# Altium schematic sheet Auxiliary.SchDoc: Auxiliary Components
size A4; DocumentNumber: 8; SheetNumber: 8; SheetTotal: 8
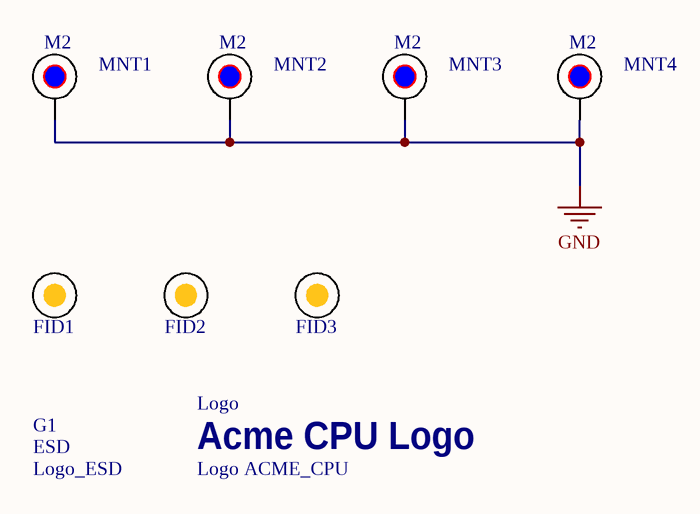
[diagram p0: Auxiliary.SchDoc]

## Parts
FID1  N/A  [Fiducial]  (value not drawn)  (no BOM)
FID2  N/A  [Fiducial]  (value not drawn)  (no BOM)
FID3  N/A  [Fiducial]  (value not drawn)  (no BOM)
G1  Logo_ESD  [Logo_ESD]  (no BOM)
Logo  Logo ACME_CPU  [LOGO_ACME_CPU]  (no BOM)
MNT1  MountHole M2. Nothing to buy or mount  [MountHole_M2]  (value not drawn)  (no BOM)
MNT2  MountHole M2. Nothing to buy or mount  [MountHole_M2]  (value not drawn)  (no BOM)
MNT3  MountHole M2. Nothing to buy or mount  [MountHole_M2]  (value not drawn)  (no BOM)
MNT4  MountHole M2. Nothing to buy or mount  [MountHole_M2]  (value not drawn)  (no BOM)

## Nets
GND: MNT1.1 MNT2.1 MNT3.1 MNT4.1

## Notes on the sheet
- Title:
- Number:
- Size:
- Date:
- A4
- Time:
- Revision:
- Sheet
- File:
- of
- (in symbol Logo ACME_CPU) Acme CPU Logo
- (in symbol Logo_ESD) ESD
- (in symbol MountHole_M2) M2

## Library data of the parts
FID1-FID3 = Fiducial: Fiducial mark.  There is nothing to buy or mount.; CompType: Fiducial; Manufacturer: N/A; MountType: N/A; PackageReference: Fiducial; Manufacturer Part Number: N/A; ClassName: PCB_FEATURE
MNT1-MNT4 = MountHole_M2: PCB Mount Hole. There is nothing to buy or mount.
G1 = Logo_ESD: ClassName: PCB_FEATURE
Logo = Logo ACME_CPU: ClassName: PCB_FEATURE